# Altium project 消防背表.PrjPcb
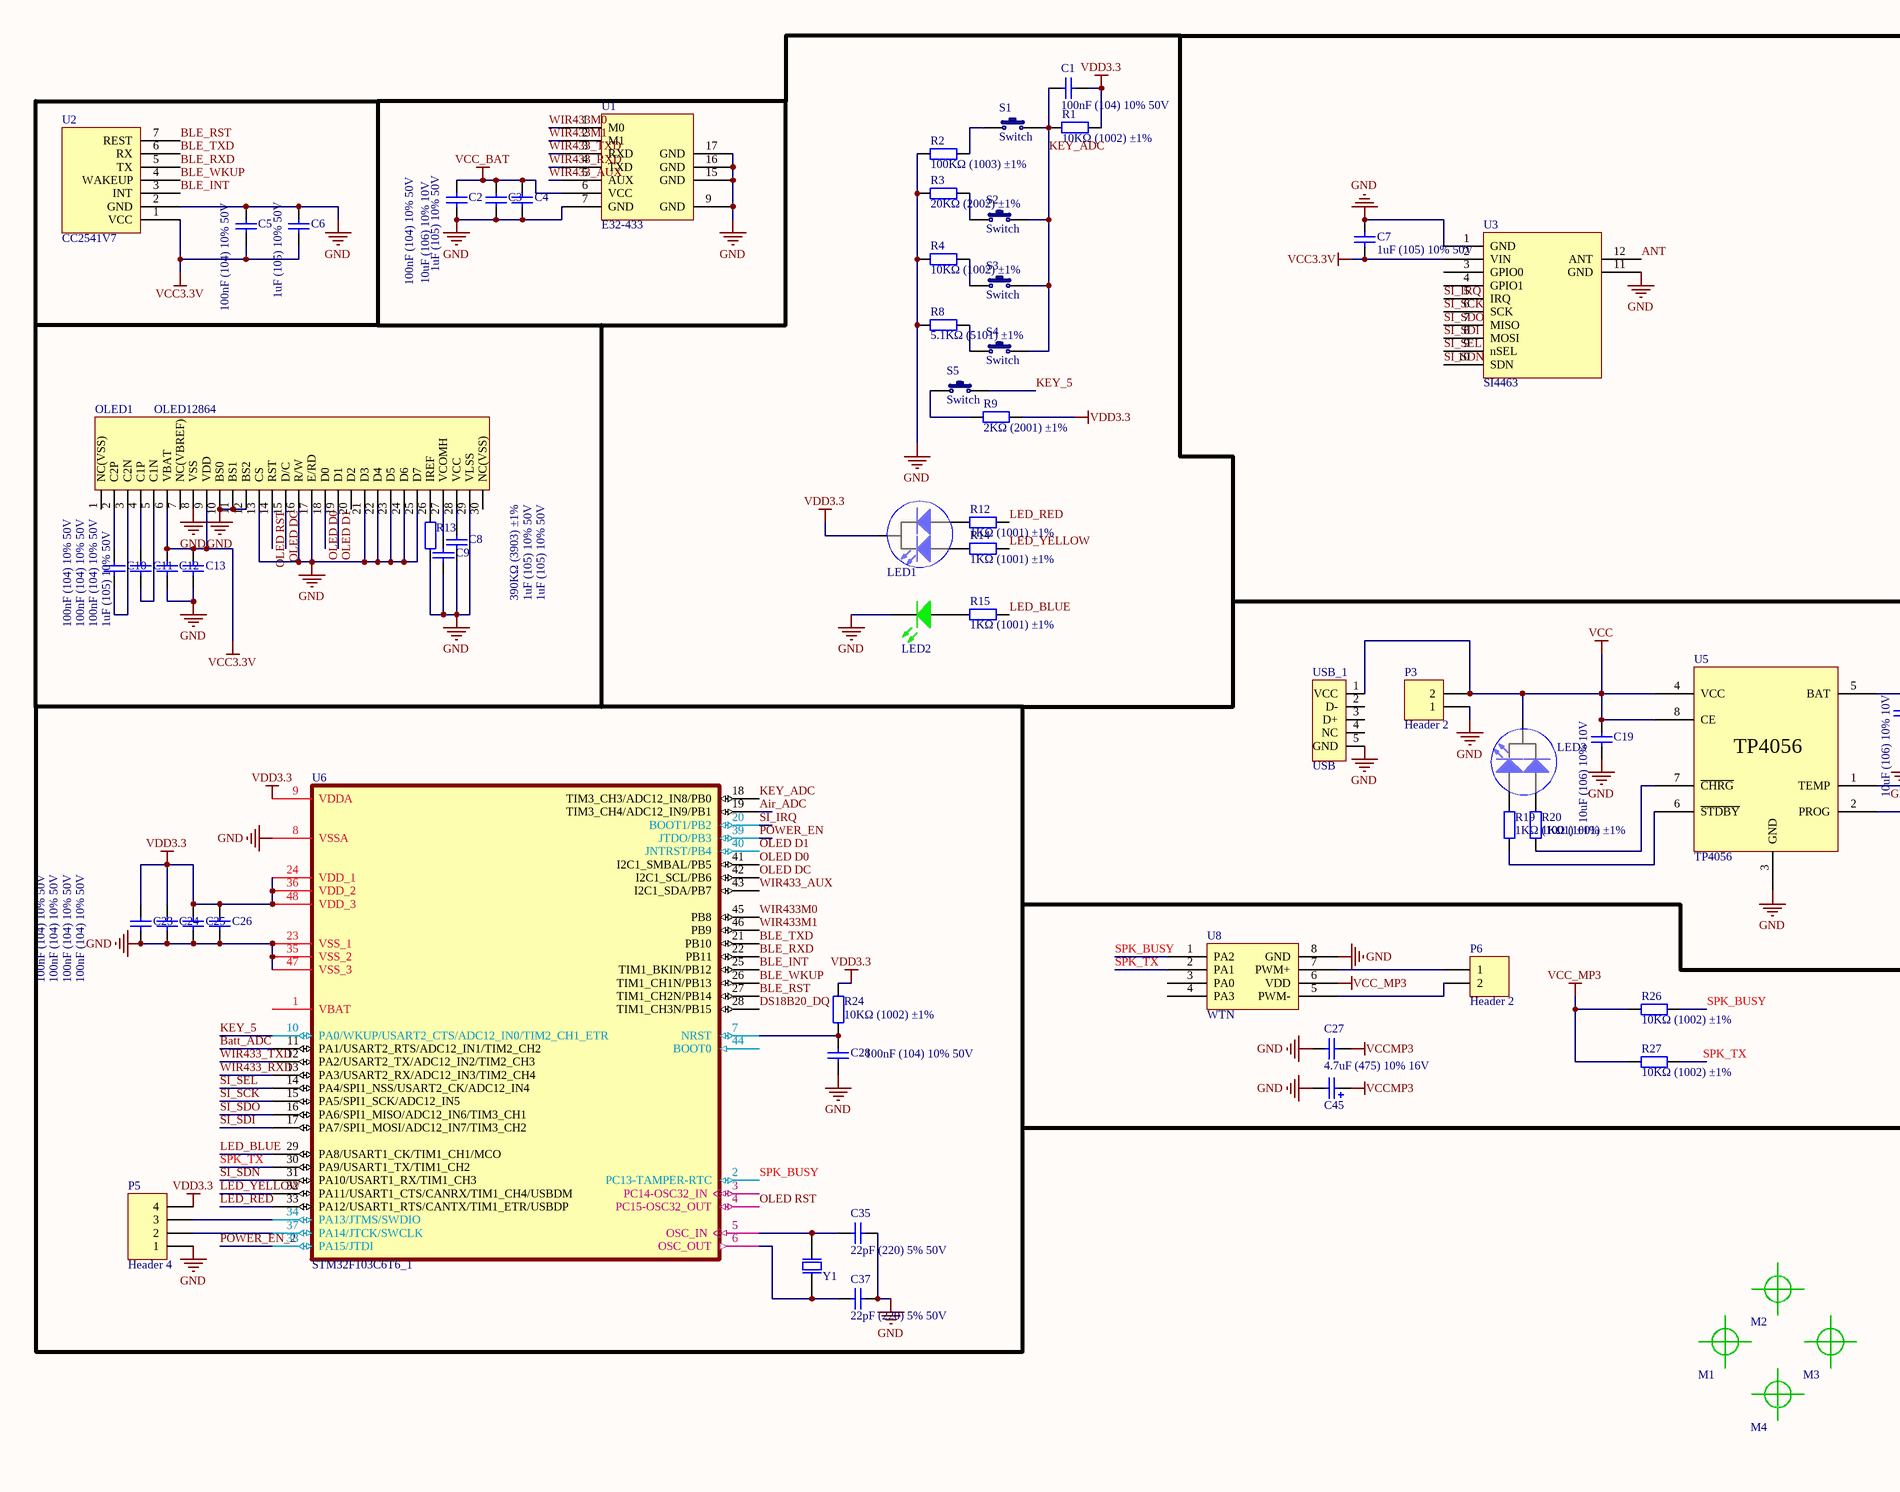
[diagram p0: 消防背表.SchDoc, left]
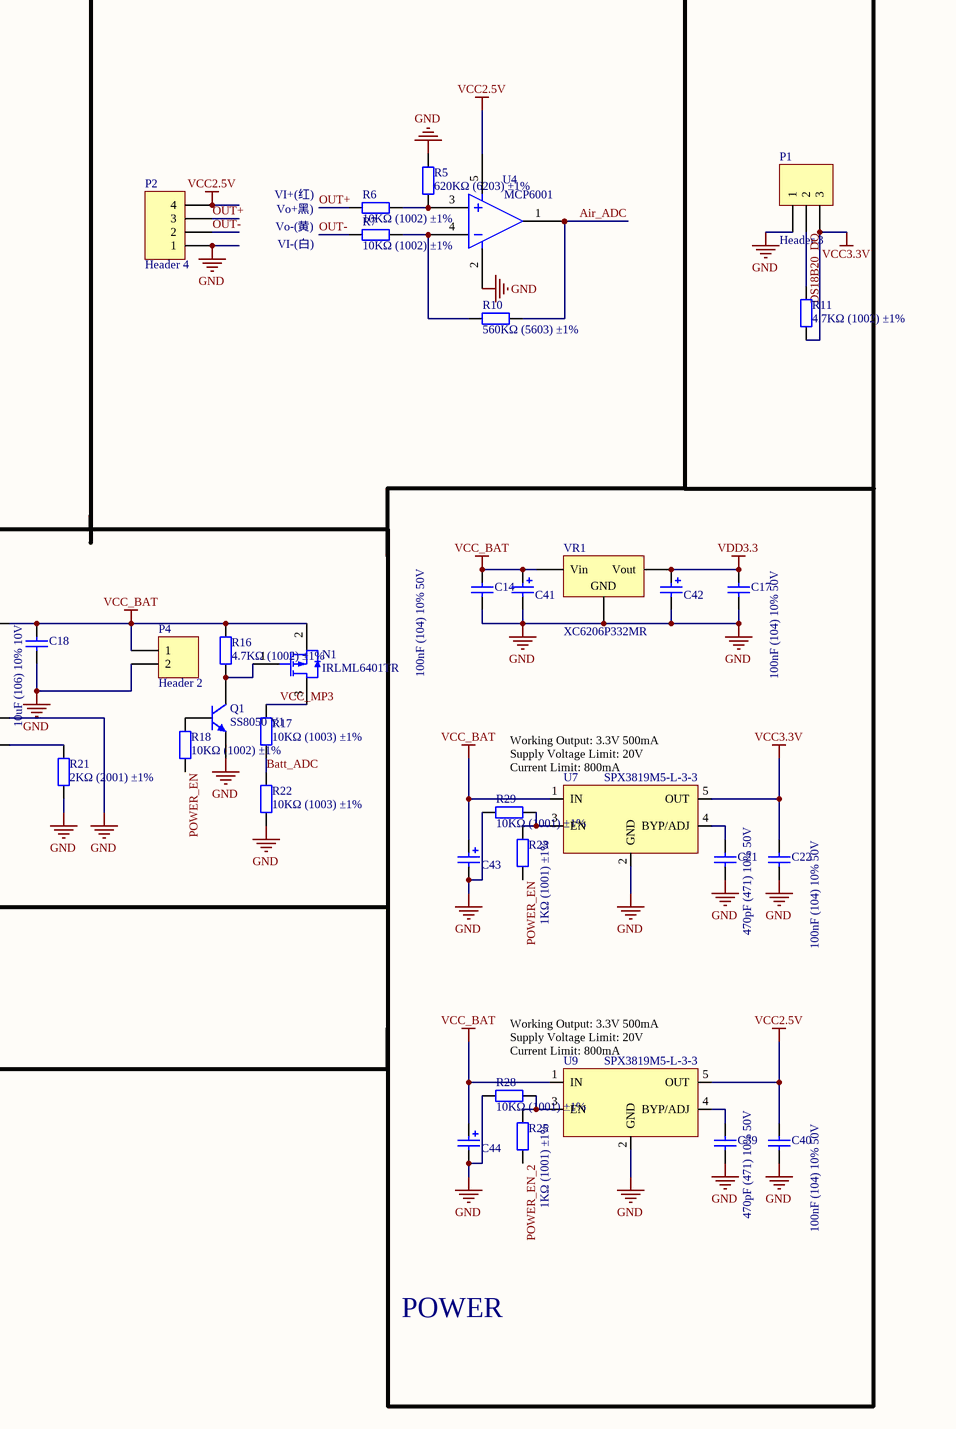
[diagram p1: 消防背表.SchDoc, right]
1 sheet, 96 parts. Net scope: global (net labels, ports and power ports of the same name join across sheets).
Board file: 消防背表.PcbDoc

## Sheet 消防背表.SchDoc
size A2

### Parts
C1  100nF (104) 10% 50V  [0603_C]
C2  1uF (105) 10% 50V  [0603_C]
C3  10uF (106) 10% 10V  [0603_C]
C4  100nF (104) 10% 50V  [0603_C]
C5  100nF (104) 10% 50V  [0603_C]
C6  1uF (105) 10% 50V  [0603_C]
C7  1uF (105) 10% 50V  [0603_C]
C8  1uF (105) 10% 50V  [0603_C]
C9  1uF (105) 10% 50V  [0603_C]
C10  100nF (104) 10% 50V  [0603_C]
C11  100nF (104) 10% 50V  [0603_C]
C12  100nF (104) 10% 50V  [0603_C]
C13  1uF (105) 10% 50V  [0603_C]
C14  100nF (104) 10% 50V  [0603_C]
C17  100nF (104) 10% 50V  [0603_C]
C18  10uF (106) 10% 10V  [0603_C]
C19  10uF (106) 10% 10V  [0603_C]
C21  470pF (471) 10% 50V  [0603_C]
C22  100nF (104) 10% 50V  [0603_C]
C23  100nF (104) 10% 50V  [0603_C]
C24  100nF (104) 10% 50V  [0603_C]
C25  100nF (104) 10% 50V  [0603_C]
C26  100nF (104) 10% 50V  [0603_C]
C27  4.7uF (475) 10% 16V  [0603_C]
C28  100nF (104) 10% 50V  [0603_C]
C35  22pF (220) 5% 50V  [0603_C]
C37  22pF (220) 5% 50V  [0603_C]
C39  470pF (471) 10% 50V  [0603_C]
C40  100nF (104) 10% 50V  [0603_C]
C41  Cap Tan  [TAN-A-3216]  (value not drawn)
C42  Cap Tan  [TAN-A-3216]  (value not drawn)
C43  Cap Tan  [TAN-A-3216]  (value not drawn)
C44  Cap Tan  [TAN-A-3216]  (value not drawn)
C45  Cap Tan  [TAN-A-3216]  (value not drawn)
LED1  LED-3-DOUBLE  [LED-R3-H5-DOUBLE]  (value not drawn)
LED2  LED-3-G  [LED-R3-H5-SINGLE-G]  (value not drawn)
LED3  LED-3-DOUBLE  [LED-R3-H5-DOUBLE]  (value not drawn)
M1  Screw Hole  [Screw hexagon 3mm]  (value not drawn)
M2  Screw Hole  [Screw hexagon 3mm]  (value not drawn)
M3  Screw Hole  [Screw hexagon 3mm]  (value not drawn)
M4  Screw Hole  [Screw hexagon 3mm]  (value not drawn)
N1  value IRLML6401TR  [SOT23-3]  (hidden comment: P-MOS)
OLED1  OLED12864  [OLED_0.96]
P1  Header 3  [HX2.54-3]
P2  Header 4  [HX2.54-4]
P3  Header 2  [HDR1X2]
P4  Header 2  [HDR1X2]
P5  Header 4  [HDR1X4]
P6  Header 2  [HDR1X2]
Q1  SS8050 Y1  [SOT-23(SOT-23-3)]
R1  10KΩ (1002) ±1%  [0603_R]
R2  100KΩ (1003) ±1%  [0603_R]
R3  20KΩ (2002) ±1%  [0603_R]
R4  10KΩ (1002) ±1%  [0603_R]
R5  620KΩ (6203) ±1%  [0603_R]
R6  10KΩ (1002) ±1%  [0603_R]
R7  10KΩ (1002) ±1%  [0603_R]
R8  5.1KΩ (5101) ±1%  [0603_R]
R9  2KΩ (2001) ±1%  [0603_R]
R10  560KΩ (5603) ±1%  [0603_R]
R11  4.7KΩ (1002) ±1%  [0603_R]
R12  1KΩ (1001) ±1%  [0603_R]
R13  390KΩ (3903) ±1%  [0603_R]
R14  1KΩ (1001) ±1%  [0603_R]
R15  1KΩ (1001) ±1%  [0603_R]
R16  4.7KΩ (1002) ±1%  [0603_R]
R17  10KΩ (1003) ±1%  [0603_R]
R18  10KΩ (1002) ±1%  [0603_R]
R19  1KΩ (1001) ±1%  [0603_R]
R20  1KΩ (1001) ±1%  [0603_R]
R21  2KΩ (2001) ±1%  [0603_R]
R22  10KΩ (1003) ±1%  [0603_R]
R23  1KΩ (1001) ±1%  [0603_R]
R24  10KΩ (1002) ±1%  [0603_R]
R25  1KΩ (1001) ±1%  [0603_R]
R26  10KΩ (1002) ±1%  [0603_R]
R27  10KΩ (1002) ±1%  [0603_R]
R28  10KΩ (1001) ±1%  [0603_R]
R29  10KΩ (1001) ±1%  [0603_R]
S1  Switch  [Switch1]
S2  Switch  [Switch1]
S3  Switch  [Switch1]
S4  Switch  [Switch1]
S5  Switch  [Switch1]
U1  E32-433  [E32_433]
U2  CC2541V7  [BLE_CC2451]
U3  SI4463  [SI4463]
U4  MCP6001  [SOT23-5]
U5  TP4056  [SOP-8_150mil]
U6  STM32F103C6T6_1  [LQFP-48]
U7  SPX3819M5-L-3-3  [SOT-23-6]
U8  WTN  [SOP-8_150mil]
U9  SPX3819M5-L-3-3  [SOT-23-6]
USB_1  USB  [USB-MINI-B]
VR1  XC6206P332MR  [SOT-23-3L]
Y1  XTAL  [XTAL-49/U_N]  (value not drawn)

### Nets
GND: C2.1 C3.1 C4.1 C5.2 C6.2 C7.1 C8.1 C9.1 C12.1 C13.1 C14.1 C17.1 C18.1 C19.1 C21.1 C22.1 C23.1 C24.1 C25.1 C26.1 C27.2 C28.1 C35.2 C37.2 C39.1 C40.1 C41.1 C42.1 C43.1 C44.1 C45.1 LED2.2(K) OLED1.8(VSS) OLED1.10(BS0) OLED1.11(BS1) OLED1.12(BS2) OLED1.13(CS) OLED1.16(R/W) OLED1.17(E/RD) OLED1.21(D3) OLED1.22(D4) OLED1.23(D5) OLED1.24(D6) OLED1.25(D7) OLED1.29(VLSS) P1.1 P2.1 P3.1 P4.2 P5.1 Q1.2(E) R2.1 R3.1 R4.1 R5.2 R8.1 R13.1 R21.1 R22.1 R28.1 R29.1 U1.7(GND) U1.9(GND) U1.15(GND) U1.16(GND) U1.17(GND) U2.2(GND) U3.1(GND) U3.11(GND) U4.2 U5.1(TEMP) U5.3(GND) U6.8(VSSA) U6.23(VSS_1) U6.35(VSS_2) U6.47(VSS_3) U7.2(GND) U8.8(GND) U9.2(GND) USB_1.5(GND) VR1.1(GND)
VCC: C19.2 LED3.1(K) P3.2 U5.4(VCC) U5.8(CE) USB_1.1(VCC)
VCC2.5V: C40.2 P2.4 U4.5 U9.5(OUT)
VCC3.3V: C5.1 C6.1 C7.2 C12.2 C13.2 C22.2 OLED1.6(VBAT) OLED1.9(VDD) P1.3 R11.2 U2.1(VCC) U3.2(VIN) U7.5(OUT)
VCC_BAT: C2.2 C3.2 C4.2 C14.2 C18.2 C41.2 C43.2 C44.2 N1.2(S) P4.1 R16.1 U1.6(VCC) U5.5(BAT) U7.1(IN) U9.1(IN) VR1.3(Vin)
VCC_MP3: N1.3(D) R17.2 R26.2 R27.2 U8.6(VDD)
VCCMP3: C27.1 C45.2
VDD3.3: C1.1 C17.2 C23.2 C24.2 C25.2 C26.2 C42.2 LED1.1(K) P5.4 R1.2 R9.2 R24.2 U6.9(VDDA) U6.24(VDD_1) U6.36(VDD_2) U6.48(VDD_3) VR1.2(Vout)
Air_ADC: R10.2 U4.1 U6.19(TIM3_CH4/ADC12_IN9/PB1)
ANT: U3.12(ANT)
Batt_ADC: R17.1 R22.2 U6.11(PA1/USART2_RTS/ADC12_IN1/TIM2_CH2)
BLE_INT: U2.3(INT) U6.25(TIM1_BKIN/PB12)
BLE_RST: U2.7(REST) U6.27(TIM1_CH2N/PB14)
BLE_RXD: U2.5(TX) U6.22(PB11)
BLE_TXD: U2.6(RX) U6.21(PB10)
BLE_WKUP: U2.4(WAKEUP) U6.26(TIM1_CH1N/PB13)
DS18B20_DQ: P1.2 R11.1 U6.28(TIM1_CH3N/PB15)
KEY_5: S5.2 U6.10(PA0/WKUP/USART2_CTS/ADC12_IN0/TIM2_CH1_ETR)
KEY_ADC: C1.2 R1.1 S1.2 S2.2 S3.2 S4.2 U6.18(TIM3_CH3/ADC12_IN8/PB0)
LED_BLUE: R15.1 U6.29(PA8/USART1_CK/TIM1_CH1/MCO)
LED_RED: R12.1 U6.33(PA12/USART1_RTS/CANTX/TIM1_ETR/USBDP)
LED_YELLOW: R14.1 U6.32(PA11/USART1_CTS/CANRX/TIM1_CH4/USBDM)
OLED D0: OLED1.18(D0) U6.41(I2C1_SMBAL/PB5)
OLED D1: OLED1.19(D1) U6.40(JNTRST/PB4)
OLED DC: OLED1.15(D/C) U6.42(I2C1_SCL/PB6)
OLED RST: OLED1.14(RST) U6.4(PC15-OSC32_OUT)
OUT+: P2.3 R6.1
OUT-: P2.2 R7.1
POWER_EN: R18.2 R23.2 U6.39(JTDO/PB3)
POWER_EN_2: R25.2 U6.38(PA15/JTDI)
SI_IRQ: U3.5(IRQ) U6.20(BOOT1/PB2)
SI_SCK: U3.6(SCK) U6.15(PA5/SPI1_SCK/ADC12_IN5)
SI_SDI: U3.8(MOSI) U6.17(PA7/SPI1_MOSI/ADC12_IN7/TIM3_CH2)
SI_SDN: U3.10(SDN) U6.31(PA10/USART1_RX/TIM1_CH3)
SI_SDO: U3.7(MISO) U6.16(PA6/SPI1_MISO/ADC12_IN6/TIM3_CH1)
SI_SEL: U3.9(nSEL) U6.14(PA4/SPI1_NSS/USART2_CK/ADC12_IN4)
SPK_BUSY: R26.1 U6.2(PC13-TAMPER-RTC) U8.1(PA2)
SPK_TX: R27.1 U6.30(PA9/USART1_TX/TIM1_CH2) U8.2(PA1)
WIR433_AUX: U1.5(AUX) U6.43(I2C1_SDA/PB7)
WIR433_RXD: U1.4(TXD) U6.13(PA3/USART2_RX/ADC12_IN3/TIM2_CH4)
WIR433_TXD: U1.3(RXD) U6.12(PA2/USART2_TX/ADC12_IN2/TIM2_CH3)
WIR433M0: U1.1(M0) U6.45(PB8)
WIR433M1: U1.2(M1) U6.46(PB9)
NetC8_2: C8.2 OLED1.28(VCC)
NetC9_2: C9.2 OLED1.27(VCOMH)
NetC10_1: C10.1 OLED1.3(C2N)
NetC10_2: C10.2 OLED1.2(C2P)
NetC11_1: C11.1 OLED1.5(C1N)
NetC11_2: C11.2 OLED1.4(C1P)
NetC21_2: C21.2 U7.4(BYP/ADJ)
NetC28_2: C28.2 R24.1 U6.7(NRST)
NetC35_1: C35.1 U6.5(OSC_IN) Y1.2(OSC2)
NetC37_1: C37.1 U6.6(OSC_OUT) Y1.1(OSC1)
NetC39_2: C39.2 U9.4(BYP/ADJ)
NetLED1_2: LED1.2(A) R14.2
NetLED1_3: LED1.3(A) R12.2
NetLED2_1: LED2.1(A) R15.2
NetLED3_2: LED3.2(A) R19.2
NetLED3_3: LED3.3(A) R20.2
NetN1_1: N1.1(G) Q1.3(C) R16.2
NetOLED1_26: OLED1.26(IREF) R13.2
NetP5_2: P5.2 U6.37(PA14/JTCK/SWCLK)
NetP5_3: P5.3 U6.34(PA13/JTMS/SWDIO)
NetP6_1: P6.1 U8.7(PWM+)
NetP6_2: P6.2 U8.5(PWM-)
NetQ1_1: Q1.1(B) R18.1
NetR2_2: R2.2 S1.1
NetR3_2: R3.2 S2.1
NetR4_2: R4.2 S3.1
NetR5_1: R5.1 R6.2 U4.3
NetR7_2: R7.2 R10.1 U4.4
NetR8_2: R8.2 S4.1
NetR9_1: R9.1 S5.1
NetR19_1: R19.1 U5.6(~{STDBY})
NetR20_1: R20.1 U5.7(~{CHRG})
NetR21_2: R21.2 U5.2(PROG)
NetR23_1: R23.1 R29.2 U7.3(EN)
NetR25_1: R25.1 R28.2 U9.3(EN)

Not connected (* = marked no-connect by the designer): OLED1 1(NC(VSS)) 7(NC(VBREF)) 20(D2) 30(NC(VSS)); U3 3(GPIO0) 4(GPIO1); U6 1(VBAT) 3(PC14-OSC32_IN) 44(BOOT0); U8 3(PA0) 4(PA3); USB_1 2(D-) 3(D+) 4(NC)

### Notes on the sheet
- VI+(红)
- Vo-(黄)
- Vo+黑)
- VI-(白)
- Working Output: 3.3V 500mA
  Supply Voltage Limit: 20V
  Current Limit: 800mA
- POWER

### Library data of the parts
C1 C4 C5 C10-C12 C14 C17 C22-C26 C28 C40 = 0603 100nF (104) 10% 50V: 贴片电容; ComponentLink1Description: 供应商链接; ComponentLink1URL: http://www.szlcsc.com/product/details_15331.html; Package: 0603; Supplier: LC; SuppliersPartNumber: C14663
C2 C6-C9 C13 = 0603 1uF (105) 10% 50V: 贴片电容; ComponentLink1Description: 供应商链接; ComponentLink1URL: http://www.szlcsc.com/product/details_16531.html; Package: 0603; Supplier: LC; SuppliersPartNumber: C15849
C3 C18 C19 = 0603 10uF (106) 10% 10V: 贴片电容; ComponentLink1Description: 供应商链接; ComponentLink1URL: http://www.szlcsc.com/product/details_20411.html; Package: 0603; Supplier: LC; SuppliersPartNumber: C19702
C21 C39 = 0603 470pF (471) 10% 50V: 贴片电容; ComponentLink1Description: 供应商链接; ComponentLink1URL: http://www.szlcsc.com/product/details_1972.html; Package: 0603; Supplier: LC; SuppliersPartNumber: C1620
C27 = 0603 4.7uF (475) 10% 16V: 贴片电容; ComponentLink1Description: 供应商链接; ComponentLink1URL: http://www.szlcsc.com/product/details_20375.html; Package: 0603; Supplier: LC; SuppliersPartNumber: C19666
C35 C37 = 0603 22pF (220) 5% 50V: 贴片电容; ComponentLink1Description: 供应商链接; ComponentLink1URL: http://www.szlcsc.com/product/details_2005.html; Package: 0603; Supplier: LC; SuppliersPartNumber: C1653
C41-C45 = Cap Tan: Polarized Capacitor (Radial); Value: 104; Voltage: 16V; Published: 8-Jun-2000; Revision: July-2002: Re-released for DXP Platform.; Publisher: Altium Limited
LED1 LED3 = LED-3-DOUBLE: Typical INFRARED GaAs LED; Published: 8-Jun-2000; Revision: July-2002: Re-released for DXP Platform.; Publisher: Altium Limited
LED2 = LED-3-G: Typical INFRARED GaAs LED; Published: 8-Jun-2000; Revision: July-2002: Re-released for DXP Platform.; Publisher: Altium Limited
P1 = Header 3: Header, 3-Pin; LatestRevisionDate: 17-Jul-2002; LatestRevisionNote: Re-released for DXP Platform.; Publisher: Altium Limited
P2 P5 = Header 4: Header, 4-Pin; LatestRevisionDate: 17-Jul-2002; LatestRevisionNote: Re-released for DXP Platform.; Publisher: Altium Limited
P3 P4 P6 = Header 2: Header, 2-Pin; LatestRevisionDate: 17-Jul-2002; LatestRevisionNote: Re-released for DXP Platform.; Publisher: Altium Limited
Q1 = SOT-23 SS8050 Y1: 三极管; ComponentLink1Description: 供应商链接; ComponentLink1URL: http://www.szlcsc.com/product/details_2507.html; Package: SOT-23; Supplier: LC; SuppliersPartNumber: C2150
R1 R4 R6 R7 R11 R16 R18 R24 = 0603 10KΩ (1002) 1%: 贴片电阻; ComponentLink1Description: 供应商链接; ComponentLink1URL: http://www.szlcsc.com/product/details_26547.html; Package: 0603; Supplier: LC; SuppliersPartNumber: C25804
R2 R17 R22 = 0603 100KΩ (1003) 1%: 贴片电阻; ComponentLink1Description: 供应商链接; ComponentLink1URL: http://www.szlcsc.com/product/details_26546.html; Package: 0603; Supplier: LC; SuppliersPartNumber: C25803
R3 = 0603 20KΩ (2002) 1%: 贴片电阻; ComponentLink1Description: 供应商链接; ComponentLink1URL: http://www.szlcsc.com/product/details_4591.html; Package: 0603; Supplier: LC; SuppliersPartNumber: C4184
R5 = 0603 620KΩ (6203) 1%: 贴片电阻; ComponentLink1Description: 供应商链接; ComponentLink1URL: http://www.szlcsc.com/product/details_23946.html; Package: 0603; Supplier: LC; SuppliersPartNumber: C23219
R8 = 0603 5.1KΩ (5101) 1%: 贴片电阻; ComponentLink1Description: 供应商链接; ComponentLink1URL: http://www.szlcsc.com/product/details_23913.html; Package: 0603; Supplier: LC; SuppliersPartNumber: C23186
R9 R21 = 0603 2KΩ (2001) 1%: 贴片电阻; ComponentLink1Description: 供应商链接; ComponentLink1URL: http://www.szlcsc.com/product/details_23702.html; Package: 0603; Supplier: LC; SuppliersPartNumber: C22975
R10 = 0603 560KΩ (5603) 1%: 贴片电阻; ComponentLink1Description: 供应商链接; ComponentLink1URL: http://www.szlcsc.com/product/details_23930.html; Package: 0603; Supplier: LC; SuppliersPartNumber: C23203
R12 R14 R15 R19 R20 R23 R25-R29 = 0603 1KΩ (1001) 1%: 贴片电阻; ComponentLink1Description: 供应商链接; ComponentLink1URL: http://www.szlcsc.com/product/details_21904.html; Package: 0603; Supplier: LC; SuppliersPartNumber: C21190
R13 = 0603 390KΩ (3903) 1%: 贴片电阻; ComponentLink1Description: 供应商链接; ComponentLink1URL: http://www.szlcsc.com/product/details_23877.html; Package: 0603; Supplier: LC; SuppliersPartNumber: C23150
U6 = STM32F103C6T6_1: STM32 ARM-based 32-bit MCU with 32 Kbytes Flash, 48-pin LQFP, Industrial Temperature; Published: *; DatasheetVersion: *; PackageVersion: *; PackageReference: *; Publisher: *; PackageDescription: *; ComponentLink1Description: *; ComponentLink1URL: *; ComponentLink2Description: *; ComponentLink2URL: *
U7 U9 = SPX3819: 500mA, Low-Noise LDO Voltage Regulator; pin to pad: 5>6
U8 = WTN6
USB_1 = USB5
VR1 = SOT-23 XC6206P332MR: 低压差线性稳压(LDO); ComponentLink1Description: 供应商链接; ComponentLink1URL: http://www.szlcsc.com/product/details_5896.html; Package: SOT-23; Supplier: LC; SuppliersPartNumber: C5446
Y1 = XTAL: Crystal Oscillator; Published: 8-Jun-2000; Revision: July-2002: Re-released for DXP Platform.; Publisher: Altium Limited